# Altium schematic sheet Parent Sheet.SchDoc
size B; SheetNumber: 1; SheetTotal: 2
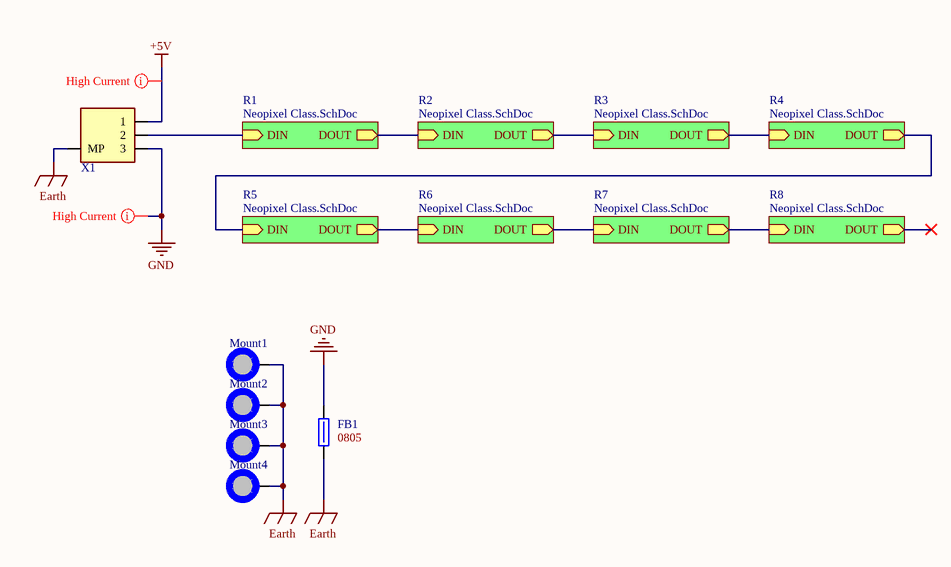
[diagram p0: Parent Sheet.SchDoc]

## Parts
FB1  Size Package: 0805  [[Ferrite] SMD 0805]  (hidden comment: 652-MH2029-300Y)
Mount1  M3 Mount Hole  [[Mount] M3 Mount Hole]  (value not drawn)  (no BOM)
Mount2  M3 Mount Hole  [[Mount] M3 Mount Hole]  (value not drawn)  (no BOM)
Mount3  M3 Mount Hole  [[Mount] M3 Mount Hole]  (value not drawn)  (no BOM)
Mount4  M3 Mount Hole  [[Mount] M3 Mount Hole]  (value not drawn)  (no BOM)
X1  [Pheonix] 3pin 2.5mm pitch  [[Pheonix] 3pin 2.5mm pitch]  (value not drawn)

## Sub-sheets
R1 = Neopixel Class.SchDoc: DIN (in), DOUT (out)
R2 = Neopixel Class.SchDoc: DIN (in), DOUT (out)
R3 = Neopixel Class.SchDoc: DIN (in), DOUT (out)
R4 = Neopixel Class.SchDoc: DIN (in), DOUT (out)
R5 = Neopixel Class.SchDoc: DIN (in), DOUT (out)
R6 = Neopixel Class.SchDoc: DIN (in), DOUT (out)
R7 = Neopixel Class.SchDoc: DIN (in), DOUT (out)
R8 = Neopixel Class.SchDoc: DIN (in), DOUT (out)

## Nets
+5V: X1.1
Earth: FB1.1 Mount1.1 Mount2.1 Mount3.1 Mount4.1 X1.MP
GND: FB1.2 X1.3
NetX1_2: X1.2 ; sheet R1/DIN
(unnamed): sheet R1/DOUT, sheet R2/DIN
(unnamed): sheet R2/DOUT, sheet R3/DIN
(unnamed): sheet R3/DOUT, sheet R4/DIN
(unnamed): sheet R4/DOUT, sheet R5/DIN
(unnamed): sheet R5/DOUT, sheet R6/DIN
(unnamed): sheet R6/DOUT, sheet R7/DIN
(unnamed): sheet R7/DOUT, sheet R8/DIN

## Layout directives
net class High_Current_Nets: +5V, GND

## Library data of the parts
FB1 = [Ferrite] SMD 0805 3A 30ohm: Res @ Freq: 30 @ 100MHz; Supplier 1: DigiKey; Supplier Part Number 1: MH2029-300YCT-ND
Mount1-Mount4 = [Mount] M3 Mount Hole: Place at least 4.5mm from board edge. Plated.
X1 = [Pheonix] 3pin 2.5mm pitch: 1778777; Supplier 1: DigiKey; Supplier Part Number 1: 277-2316-1-ND